# EAGLE schematic board (EAGLE 9.6.2)
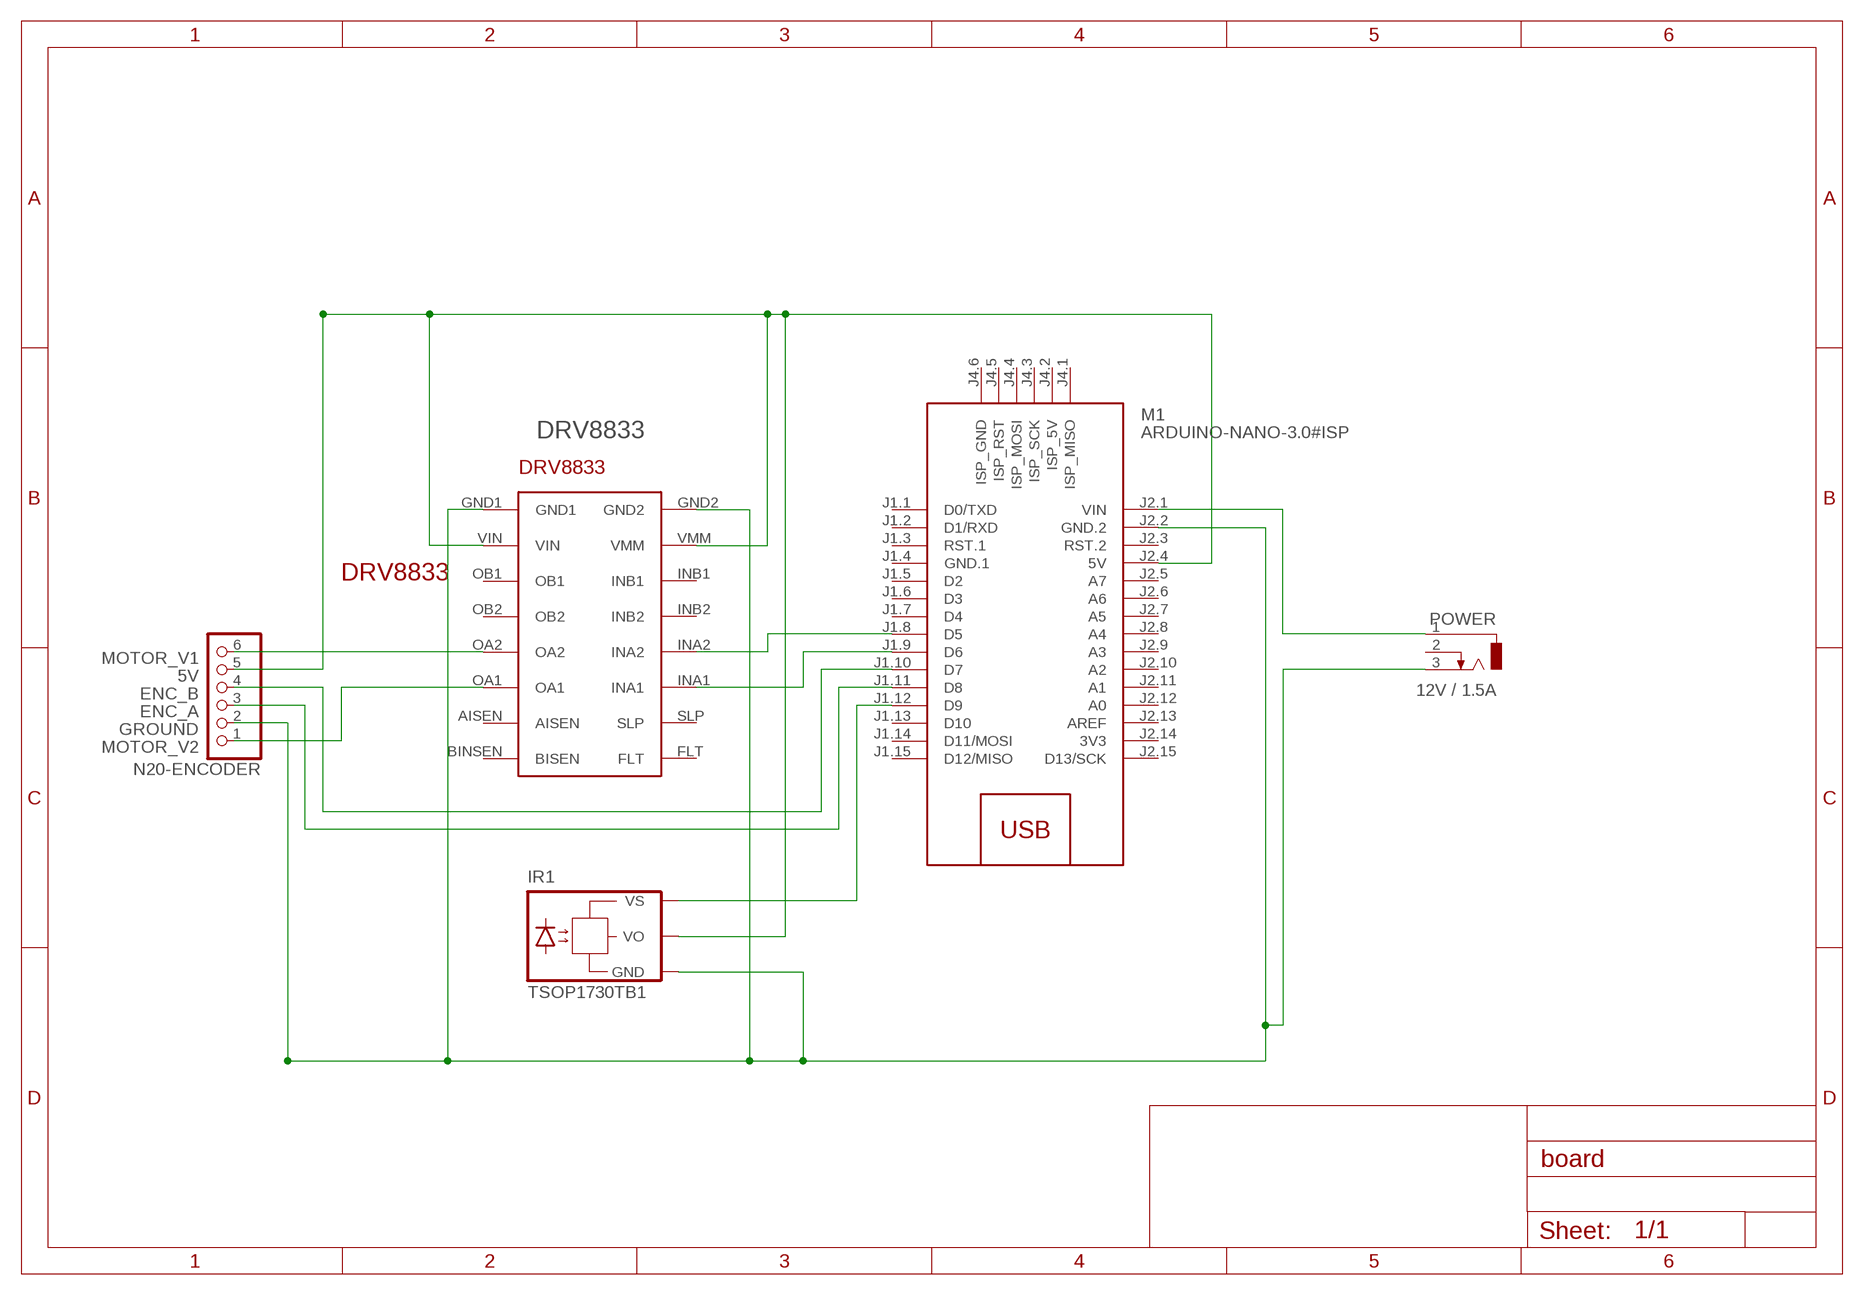
[diagram p0: schematic, sheet 1]

## Parts
DRV8833  POLOLU-DRV8833  [POLOLU-DRV8833]
IR1  TSOP1730TB1  [TSOP17_TB1]
M1  ARDUINO-NANO-3.0#ISP  [ARDUINO-NANO-3.0#ISP]
N20-ENCODER  PINHD-1X6  [1X06]
POWER  12V / 1.5A  DCJ0303  [DCJ0303]

## Nets
5V: DRV8833.VIN DRV8833.VMM IR1.VO M1.J2.4(5V) N20-ENCODER.5
ENC_A: M1.J1.11(D8) N20-ENCODER.3
ENC_B: M1.J1.10(D7) N20-ENCODER.4
GROUND: DRV8833.GND1 DRV8833.GND2 IR1.GND M1.J2.2(GND.2) N20-ENCODER.2 POWER.3
IR_SIGNAL: IR1.VS M1.J1.12(D9)
MOTOR_CONTROL_1: DRV8833.INA2 M1.J1.8(D5)
MOTOR_V1: DRV8833.OA2 N20-ENCODER.6
MOTOR_V2: DRV8833.OA1 N20-ENCODER.1
N$1: DRV8833.INA1 M1.J1.9(D6)
POWER_VCC: M1.J2.1(VIN) POWER.1
Unconnected: DRV8833.AISEN DRV8833.BINSEN(BISEN) DRV8833.FLT DRV8833.INB1 DRV8833.INB2 DRV8833.OB1 DRV8833.OB2 DRV8833.SLP M1.J1.1(D0/TXD) M1.J1.2(D1/RXD) M1.J1.3(RST.1) M1.J1.5(D2) M1.J1.6(D3) M1.J1.7(D4) M1.J1.13(D10) M1.J1.14(D11/MOSI) M1.J1.15(D12/MISO) M1.J2.3(RST.2) M1.J2.5(A7) M1.J2.6(A6) M1.J2.7(A5) M1.J2.8(A4) M1.J2.9(A3) M1.J2.10(A2) M1.J2.11(A1) M1.J2.12(A0) M1.J2.13(AREF) M1.J2.15(D13/SCK) M1.J4.1(ISP_MISO) M1.J4.2(ISP_5V) M1.J4.3(ISP_SCK) M1.J4.4(ISP_MOSI) M1.J4.5(ISP_RST) M1.J4.6(ISP_GND) POWER.2

## Power pins joined to a net without a drawn wire
3V3: M1.J2.14(3V3)
GND.1: M1.J1.4(GND.1)

## Library data of the parts
DRV8833 = Pololu_Driver_DRV8833:POLOLU-DRV8833: Created by: Deltarios DRV8833 pololu dual drive controller, PCB-ready device
IR1 = telefunken:TSOP17*TB1: TSOP17..TB1 IR Receiver Modules for Remote Control Systems Source: http://www.vishay.com/docs/82042/82042.pdf; OC_FARNELL: unknown; OC_NEWARK: unknown
M1 = diy-modules:ARDUINO-NANO-3.0#ISP: Arduino Nano 3.0 with ISP pads
N20-ENCODER = Connector:PINHD-1X6: PIN HEADER; CATEGORY: CONNECTOR; SUB-CATEGORY: PIN-HEADER
POWER = con-jack:DCJ0303: DC POWER JACK Source: DCJ0303.pdf; OC_FARNELL: unknown; OC_NEWARK: unknown

## Module DC_N20_6V
Ports: 

### Library data of the parts